# Altium schematic sheet 1.2GHz Comb Gen Driver.SchDoc: 1.2GHz Comb Gen Driver
size D; Date: 09-24-10; DrawnBy: C. Lewis; Engineer: C. Lewis; Address1: 4650 NORRIS CANYON RD.; Address2: SAN RAMON, CA 94583; DocumentNumber: 35133; Revision: D; SheetNumber: 11; SheetTotal: 20; PageSetup: Record=PageOptions|CenterHorizontal=True|CenterVertical=True|PrintScale=0.51|XCorrection=1.00|YCorrection=1.00|PrintKind=1|BorderSize=5000000|LeftOffset=0|BottomOffset=0|Orientation=2|PaperLength=1000|PaperWidth=1000|Scale=100|PaperSource=15|PrintQuality=600|MediaType=1|DitherType=10|PaperKind=11x17|PrintScaleMode=1; DocumentName: Sheet1.SCHDOC; ModifiedDate: 10-27-11
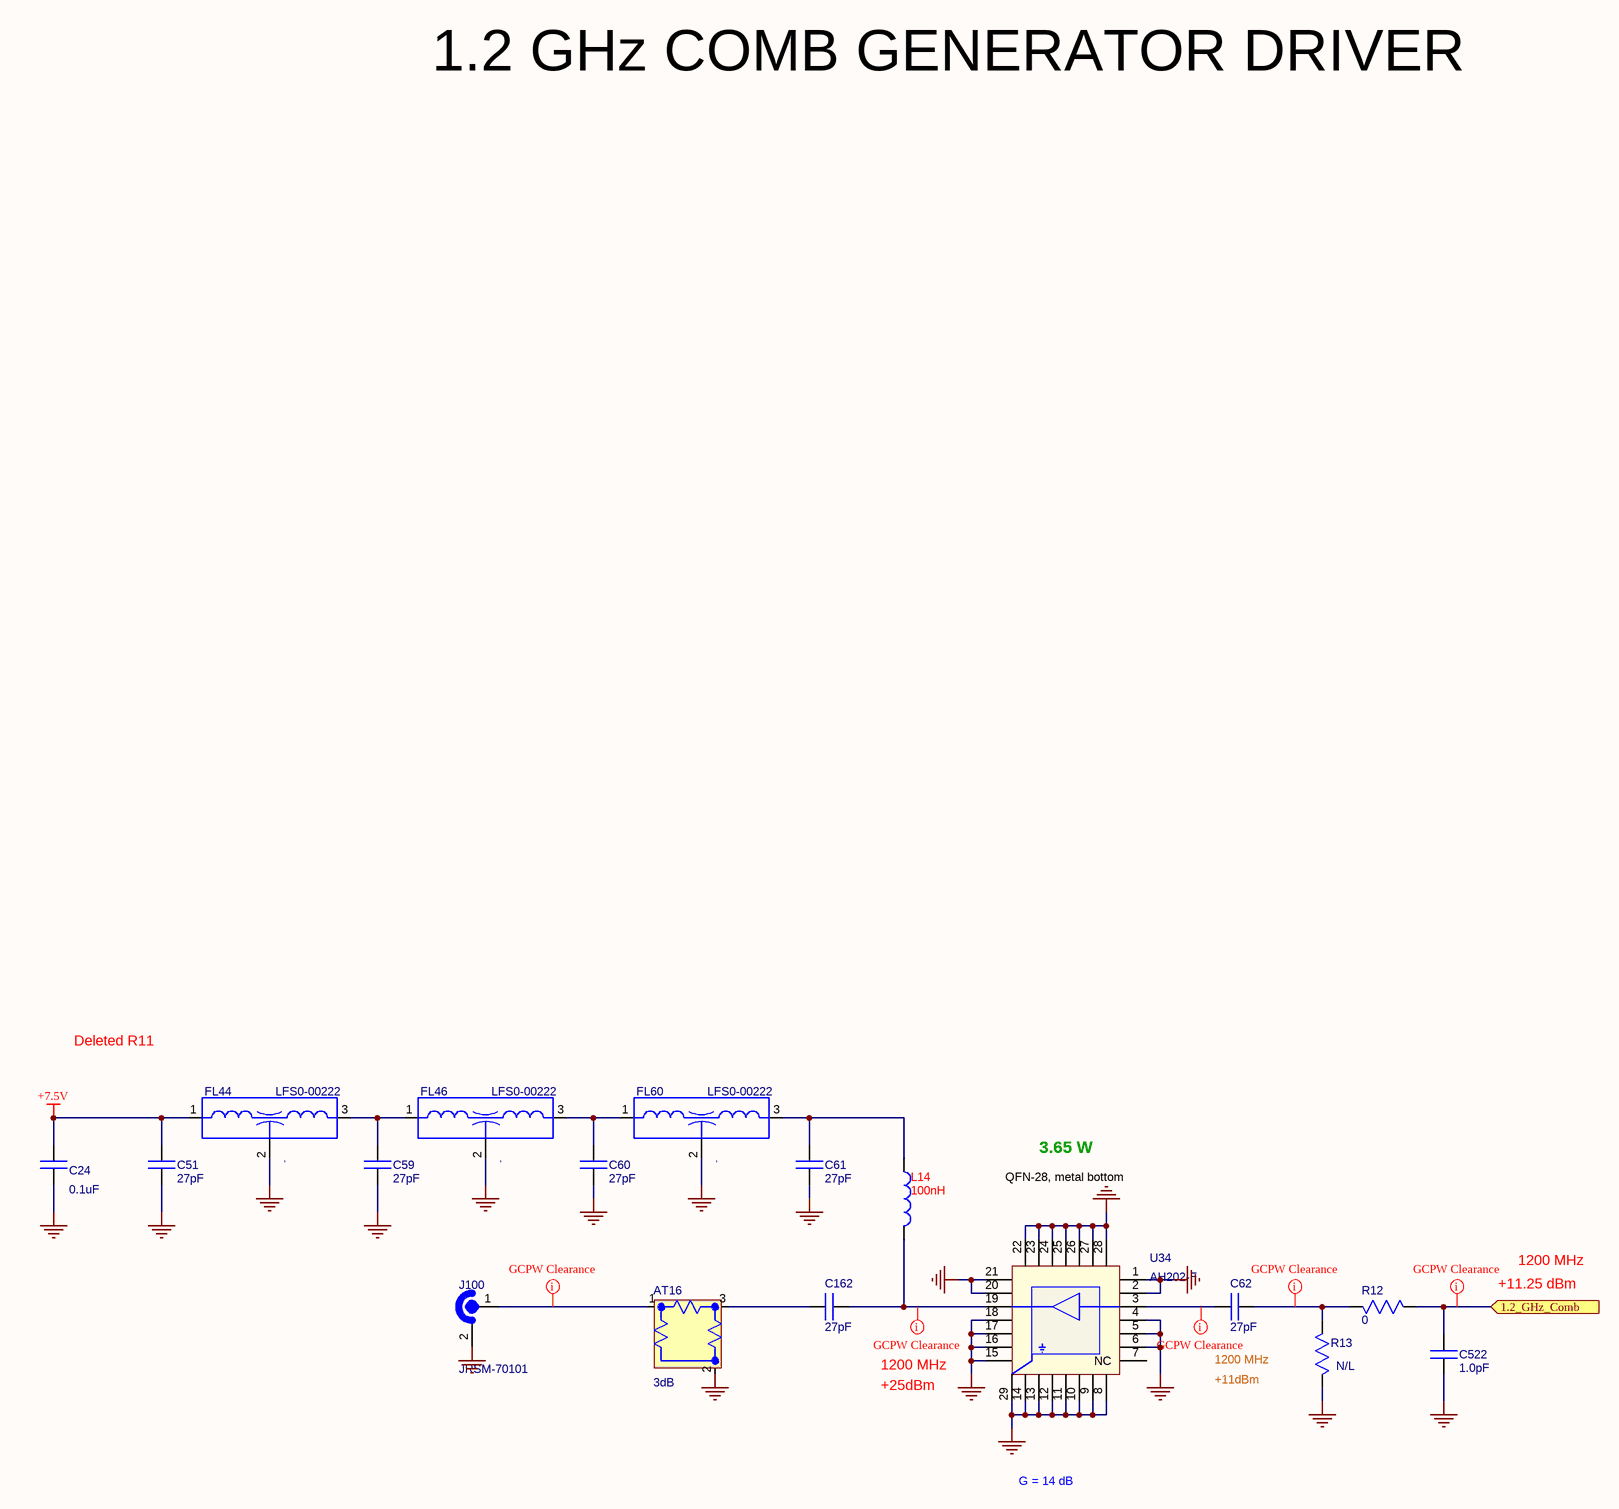
[diagram p0: 1.2GHz Comb Gen Driver.SchDoc]

## Parts
AT16  value 3dB  [ATTN-IMS-0805]  (hidden comment: PAD;CHIP;3dB;+/-.3dB;.08 x .05;50 OHM;FACE DOWN)
C24  value 0.1uF  [CAP-0603-H035-N]  (hidden comment: .1UF;10%;X7R;16V;CHIP;0603)
C51  value 27pF  [CAP-0402-N]  (hidden comment: 27 PF;5%;COG;>50V;CHIP;0402)
C59  value 27pF  [CAP-0402-N]  (hidden comment: 27 PF;5%;COG;>50V;CHIP;0402)
C60  value 27pF  [CAP-0402-N]  (hidden comment: 27 PF;5%;COG;>50V;CHIP;0402)
C61  value 27pF  [CAP-0402-N]  (hidden comment: 27 PF;5%;COG;>50V;CHIP;0402)
C62  value 27pF  [CAP-0402-N]  (hidden comment: 27 PF;5%;COG;>50V;CHIP;0402)
C162  value 27pF  [CAP-0402-N]  (hidden comment: 27 PF;5%;COG;>50V;CHIP;0402)
C522  value 1.0pF  [CAP-0402-RF]  (hidden comment: 1.0 PF;200V;.05PF;HIGH Q;SMT;CERAMIC;0402)
FL44  Filter EMI 2200PF,1206  [FIL-NFE31P-1206-4P]  (value not drawn)
FL46  Filter EMI 2200PF,1206  [FIL-NFE31P-1206-4P]  (value not drawn)
FL60  Filter EMI 2200PF,1206  [FIL-NFE31P-1206-4P]  (value not drawn)
J100  .  [JRSM-70101]  (value not drawn)
L14  value 100nH  [IND-1008HT]  (hidden comment: INDUCTOR;100NH;5%;1.2G SRF;40Q@.25G;420mA;1008HT)
R12  value 0  [RES-0402-N]  (hidden comment: JUMPER;0 OHMS;SMT;0402)
R13  NoLoad: N/L  [RES-0402-N]  (hidden comment: 422 OHMS; 1%; .1W; 100PPM; FILM; CHIP; 0402)
U34  M_PN: AH202-F  [QFN65P600X600X100-29]  (hidden comment: AMP;.05-2.2GHZ;+30DBM;11V;330MA;QFN-28 W/G)

## Ports
1.2_GHz_Comb

## Nets
+7.5V: C24.1 C51.1 FL44.1(IN)
GND: AT16.2(GND) C24.2 C51.2 C59.2 C60.2 C61.2 C522.1 FL44.2(GND) FL46.2(GND) FL60.2(GND) J100.2(GND) R13.2 U34.1(GND) U34.2(GND) U34.4(GND) U34.5(GND) U34.6(GND) U34.8(GND) U34.9(GND) U34.10(GND) U34.11(GND) U34.12(GND) U34.13(GND) U34.14(GND) U34.15(GND) U34.16(GND) U34.17(GND) U34.18(GND) U34.20(GND) U34.21(GND) U34.22(GND) U34.23(GND) U34.24(GND) U34.25(GND) U34.26(GND) U34.27(GND) U34.28(GND) U34.29(GND)
1.2_GHz_Comb: C522.2 R12.1 ; port 1.2_GHz_Comb
NetAT16_1: AT16.1(IN/OUT) J100.1(CNTR)
NetAT16_3: AT16.3(IN/OUT) C162.1
NetC59_1: C59.1 FL44.3(OUT) FL46.1(IN)
NetC60_1: C60.1 FL46.3(OUT) FL60.1(IN)
NetC61_1: C61.1 FL60.3(OUT) L14.1
NetC62_1: C62.1 R12.2 R13.1
NetC62_2: C62.2 U34.3(In)
NetC162_2: C162.2 L14.2 U34.19(GND)

Not connected (* = marked no-connect by the designer): U34 7(NC)

## Layout directives
net class GCPW Clearance: 1.2_GHz_Comb, NetAT16_1, NetC62_1, NetC62_2, NetC162_2

## Notes on the sheet
- 1.2 GHz COMB GENERATOR DRIVER
- Deleted R11
- QFN-28, metal bottom
- 3.65 W
- 1200 MHz
- +11.25 dBm
- +25dBm
- +11dBm
- G = 14 dB
- Title
- Sheet Title
- PRINTED DOCUMENT IS CONSIDERED UNCONTROLLED. VERIFY REVISION IN PLM SYSTEM.
- THIS DOCUMENT CONTAINS PROPRIETARY INFORMATION. DESIGN RIGHTS BELONG TO GIGA-TRONICS AND MAY NOT BE REPRODUCED WITHOUT WRITTEN AUTHORIZATION FOR ANY REASON EXCEPT CALIBRATION, OPERATION AND MAINTENANCE.
- Size
- CAGE CODE
- Filename
- D
- Document Number
- 58900
- Date
- Sheet
- Rev
- of
- (in symbol LFS0-00222) ,

## Library data of the parts
AT16 = MPFC-A1003: NoLoad: .; Approved: CL; M_PN: IMS1141-03DB; MFGR: IMS RESISTORS; level: 1; line_number: 25; item_number: MPFC-A1003
C24 = CK45-04100: Approved: CL; NoLoad: .; MFGR: ANY; level: 1; line_number: 105; G_PN: CK45-04100; ModifyDate: 02/22/12; M_PN: ANY; item_number: CK45-04100
C51 C59-C62 C162 = CK40-00270: Approved: CL; NoLoad: .; M_PN: ANY; level: 1; line_number: 215; G_PN: CK40-00270; ModifyDate: 02/22/12; MFGR: ANY; item_number: CK40-00270
C522 = CK41-00010: Approved: CL; NoLoad: .; MFGR: ATC; M_PN: 600L1R0AT200; level: 1; line_number: 220; G_PN: CK41-00010; ModifyDate: 3/7/13; item_number: CK41-00010
FL44 FL46 FL60 = LFS0-00222: Approved: CL; NoLoad: .; M_PN: NFE31PT222Z1E9BL; MFGR: MURATA; level: 1; line_number: 335; G_PN: LFS0-00222; ModifyDate: 02/22/12; Value: 2200pF; item_number: LFS0-00222
J100 = JRSM-70101: SMPM FD MALE,STRAIGHT SMT, R/A COPLANAR, 4 PIN THRU-HOLE; Value: B012-P93-02; MFGR: GILBERT; Approved: CL; level: 1; line_number: 480; M_PN: B012-P93-02; NoLoad: .; ModifyDate: 10/15/14; G_PN: JRSM-70101; item_number: JRSM-70101
L14 = LSA5-04100: M_PN: 1008HT-R10TJLB; MFGR: COILCRAFT; NoLoad: .; Approved: CL; level: 1; line_number: 520; G_PN: LSA5-04100; ModifyDate: 2/19/15; item_number: LSA5-04100
R12 = RK35-00000: Approved: CL; NoLoad: .; M_PN: ANY; level: 1; line_number: 1005; G_PN: RK35-00000; ModifyDate: 02/22/12; MFGR: ANY; item_number: RK35-00000
R13 = RK35-04220: Value: 422; MFGR: ANY; Approved: CL; level: 1; ModifyDate: 02/22/12; G_PN: RK35-04220; M_PN: ANY; item_number: RK35-04220
U34 = MA17-10002: MFGR: TRIQUINT; Approved: CL; Value: AHA202-F; NoLoad: .; level: 1; line_number: 1190; ModifyDate: 4/1/12; G_PN: MA17-10002; item_number: MA17-10002